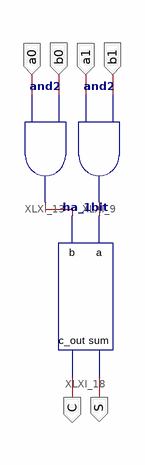
[diagram p0: schematic sheet 1]
// Xilinx ISE schematic mul_ha.sch (spartan3e) as structural Verilog: 3 symbols, 6 ports
module mul_ha (
  input  a0,
  input  b0,
  input  a1,
  input  b1,
  output C,
  output S
);

  wire XLXN_18, XLXN_19;

  and XLXI_9 (XLXN_19, a1, b1);
  and XLXI_13 (XLXN_18, a0, b0);
  ha_1bit XLXI_18 (.a(XLXN_19), .b(XLXN_18), .sum(S), .c_out(C));
endmodule
